# EAGLE design Patch-Prop (EAGLE 6.4)
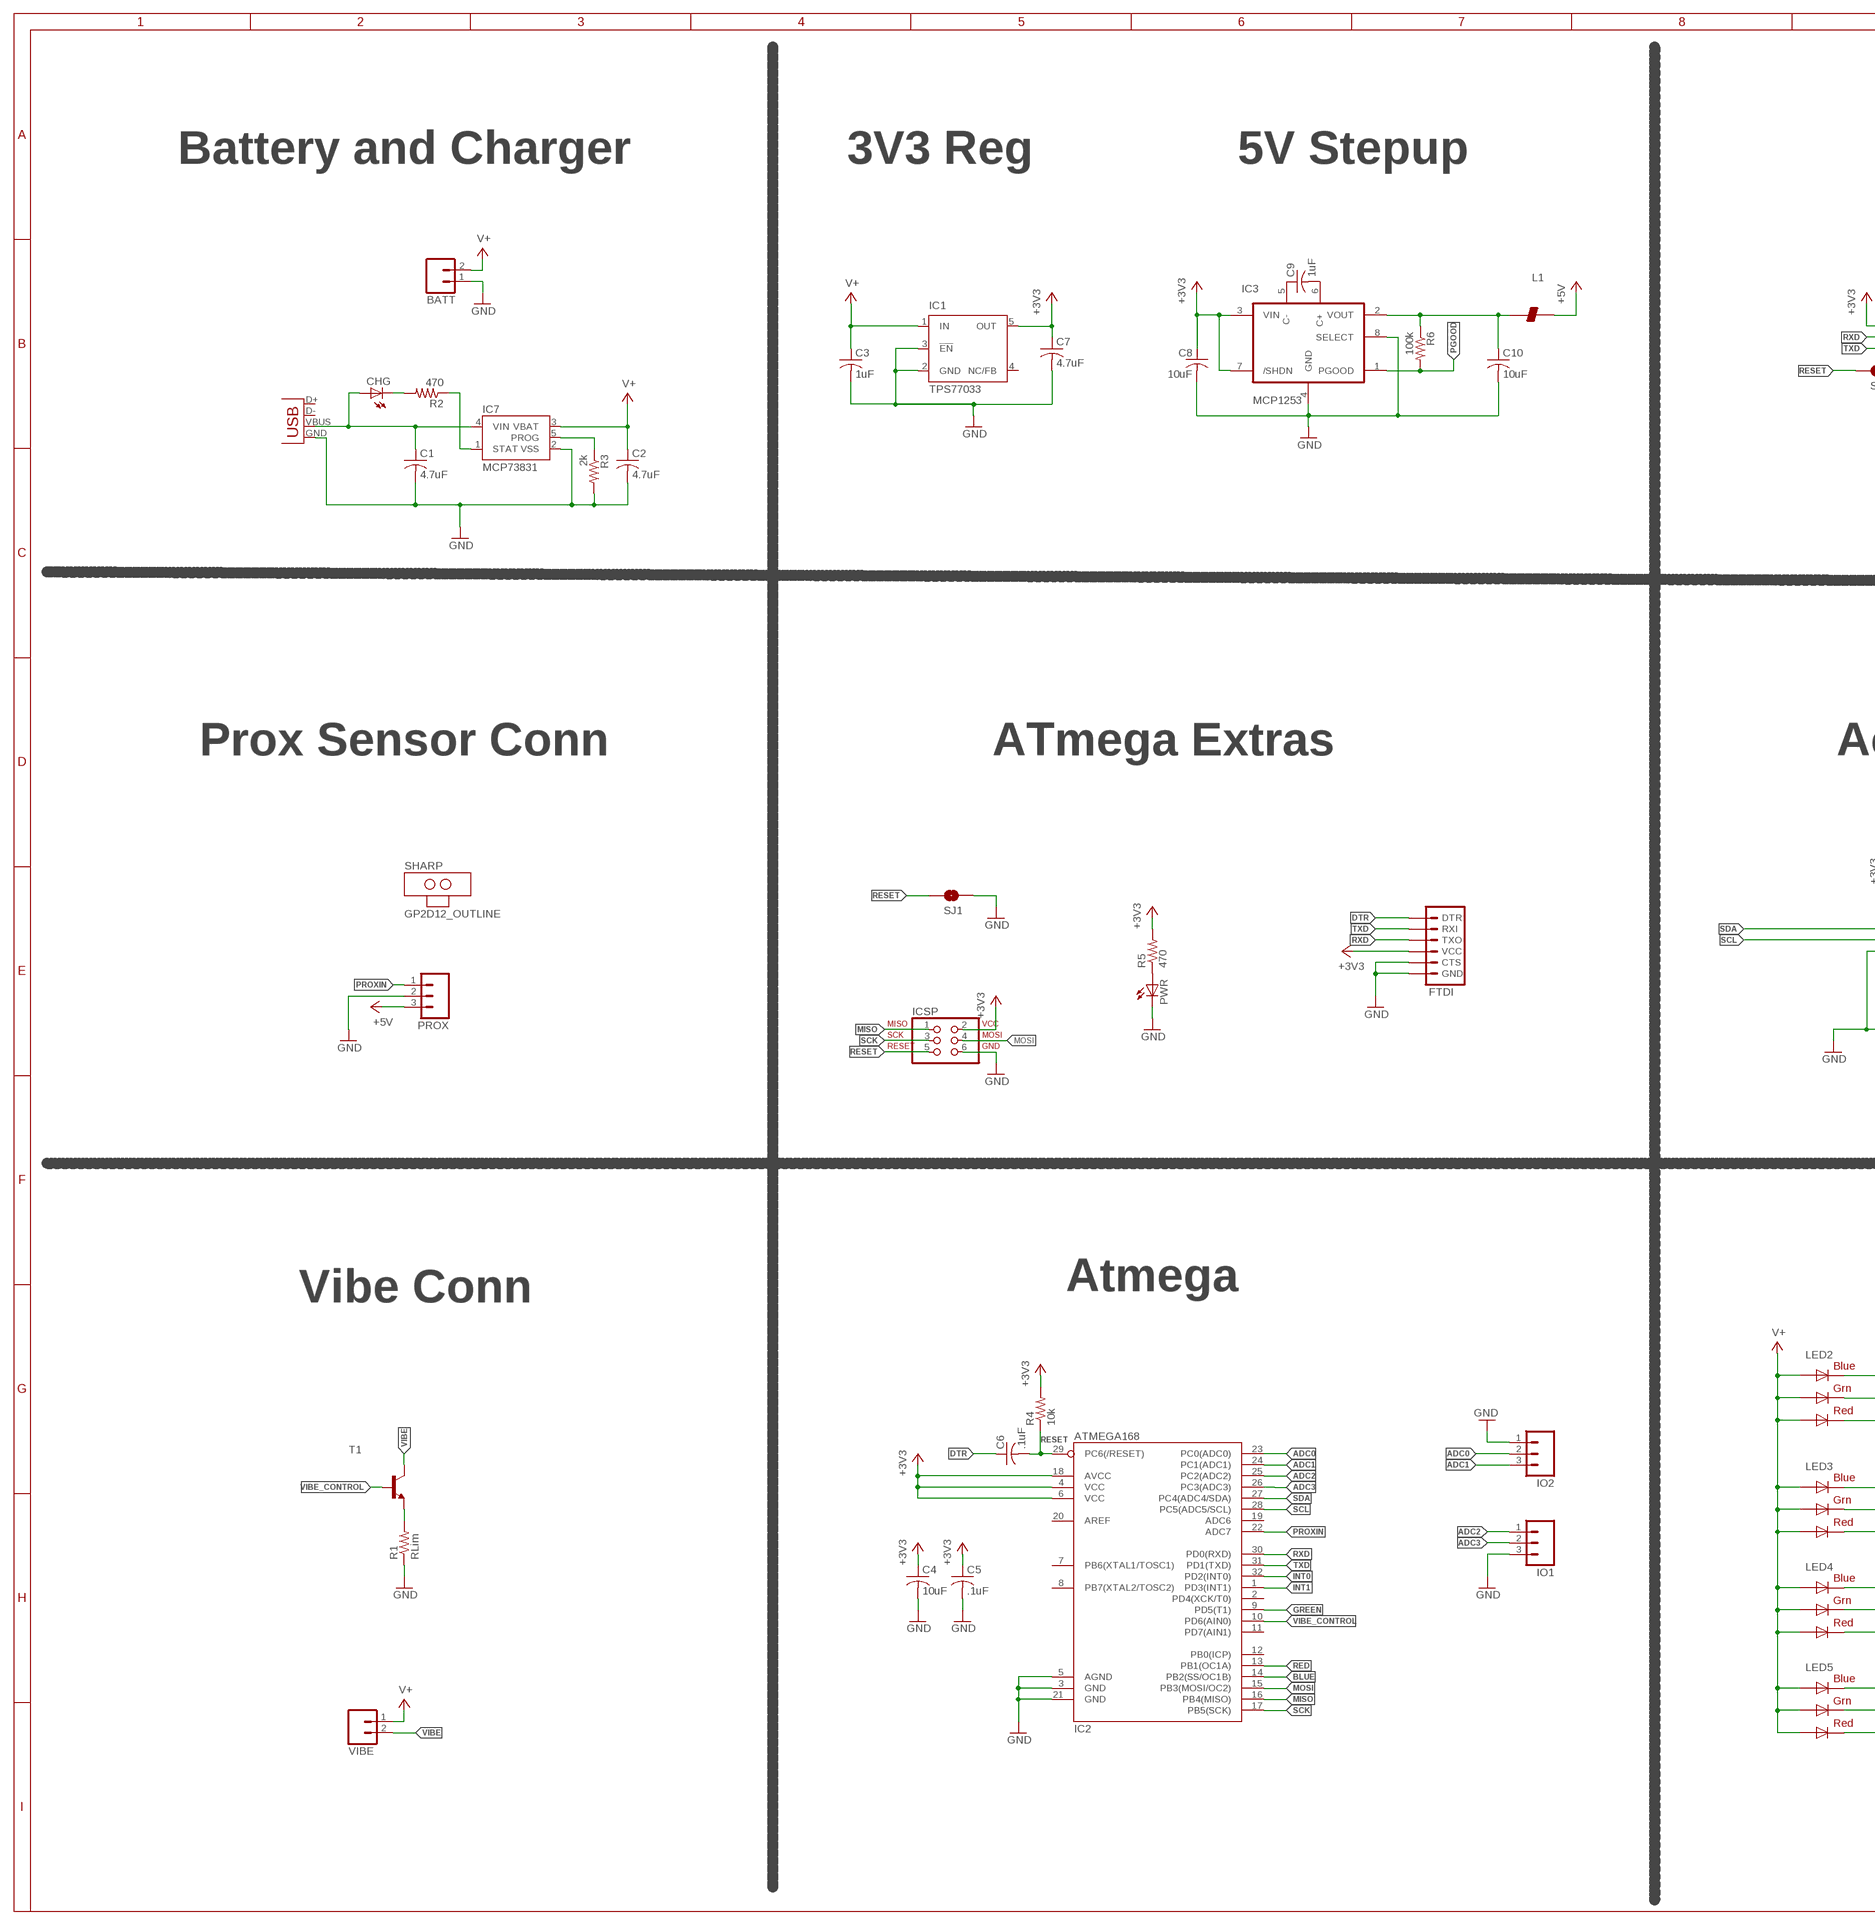
[diagram p0: schematic, sheet 1, part 1 of 2]
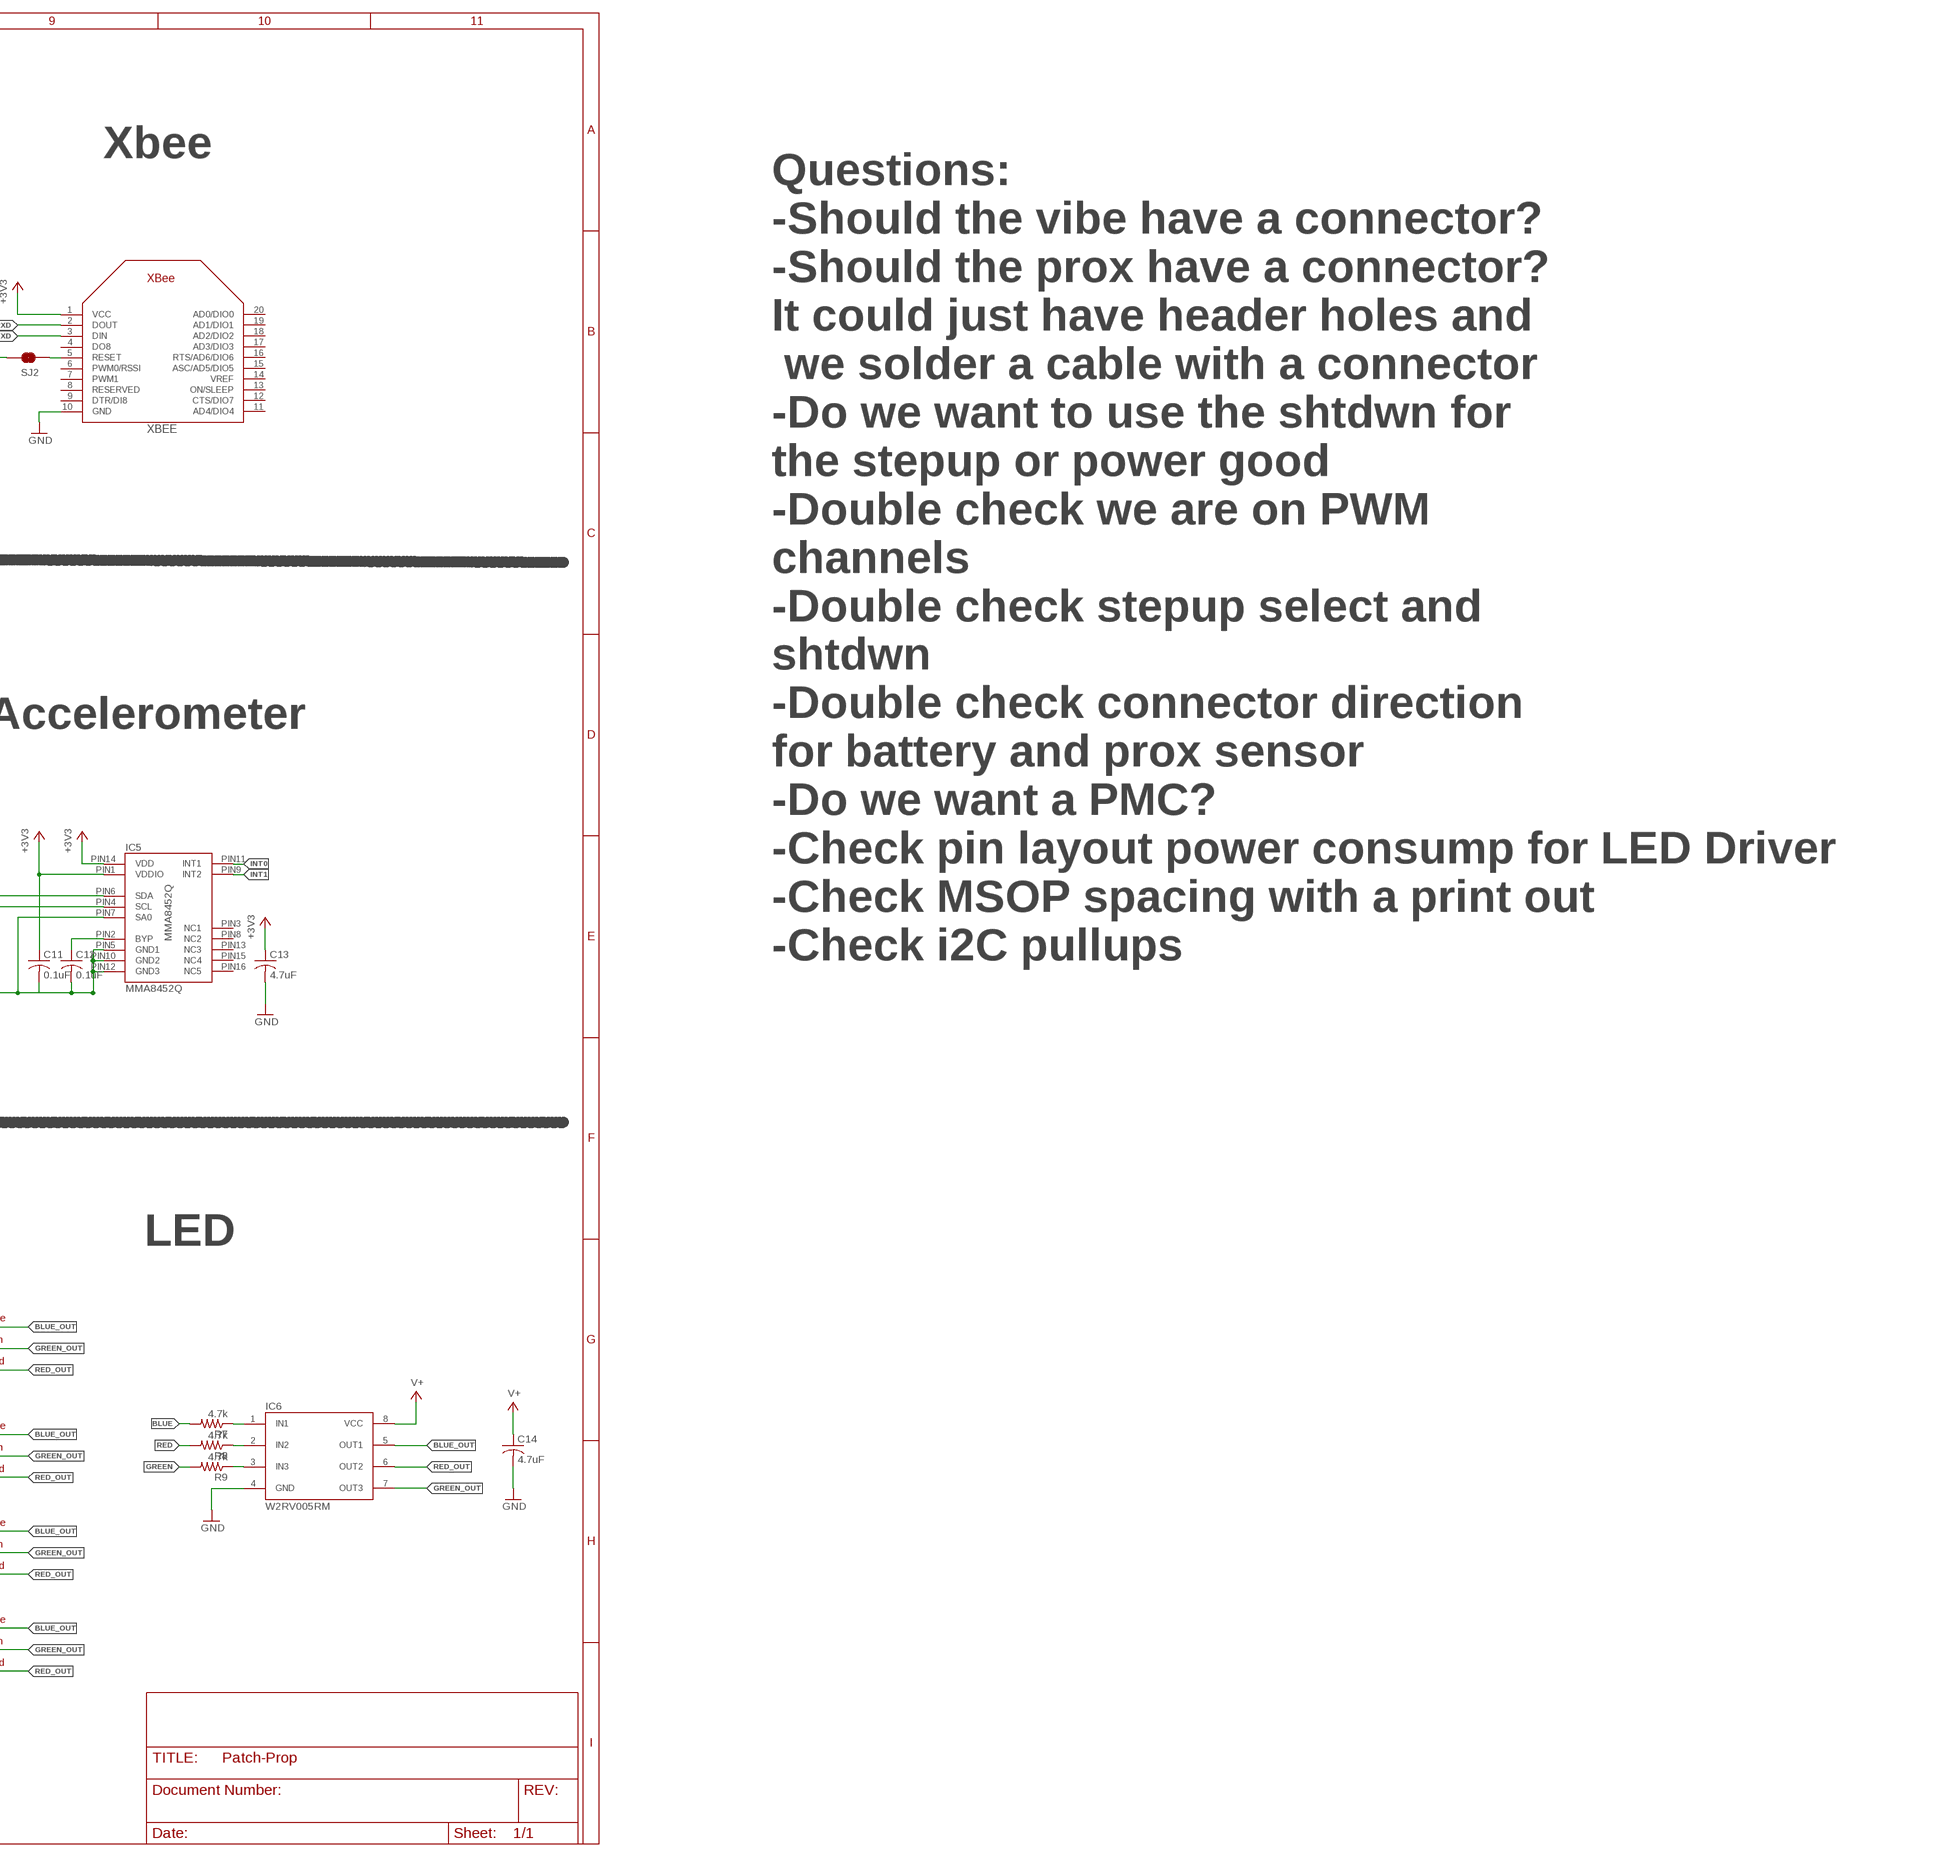
[diagram p1: schematic, sheet 1, part 2 of 2]

## Parts
BATT  M02-JST-2MM-SMT  [JST-2-SMD]
C1  4.7uF  C-USC0603  [C0603]
C2  4.7uF  C-USC0603  [C0603]
C3  1uF  C-USC0603  [C0603]
C4  10uF  C-USC0603  [C0603]
C5  .1uF  C-USC0603  [C0603]
C6  .1uF  C-USC0603  [C0603]
C7  4.7uF  C-USC0603  [C0603]
C8  10uF  C-USC0603  [C0603]
C9  1uF  C-USC0603  [C0603]
C10  10uF  C-USC0603  [C0603]
C11  0.1uF  C-USC0603  [C0603]
C12  0.1uF  C-USC0603  [C0603]
C13  4.7uF  C-USC0603  [C0603]
C14  4.7uF  C-USC0603  [C0603]
CHG  LEDCHIPLED_0805  [CHIPLED_0805]
FTDI  ARDUINO_SERIAL_PROGRAMPTH  [1X06]
IC1  TPS77033  [SOT23-DBV]
IC2  ATMEGA168  [TQFP32-08]
IC3  MCP1253  [MSOP8]
IC5  MMA8452Q  [QFN-16]
IC6  W2RV005RM  [MSOP8]
IC7  MCP73831  MCP73831SMD  [SOT23-5]
ICSP  ISP-AVR910SMD  [2X03_BORDER]
IO1  M03PTH  [1X03]
IO2  M03PTH  [1X03]
L1  BEAD-0805  [0805]
LED2  RGBLED5050  [RGBLED5050]
LED3  RGBLED5050  [RGBLED5050]
LED4  RGBLED5050  [RGBLED5050]
LED5  RGBLED5050  [RGBLED5050]
PROX  M03PTH  [1X03]
PWR  LEDCHIPLED_0805  [CHIPLED_0805]
R1  RLim  R-US_R0603  [R0603]
R2  470  R-US_R0603  [R0603]
R3  2k  R-US_R0603  [R0603]
R4  10k  R-US_R0603  [R0603]
R5  470  R-US_R0603  [R0603]
R6  100k  R-US_R0603  [R0603]
R7  4.7k  R-US_R0603  [R0603]
R8  4.7k  R-US_R0603  [R0603]
R9  4.7k  R-US_R0603  [R0603]
SHARP  GP2D12_OUTLINE  [GP2D12_OUTLINE]
SJ1  SOLDERJUMPERNO  [SJ_2S-NO]
SJ2  SOLDERJUMPERNO  [SJ_2S-NO]
T1  -NPN-SOT23-EBC  [SOT23-EBC]
USB  USBSMD  [USB-MINIB]
VIBE  M02PTH  [1X02]
XBEE  XBEE  [XBEE]

## Nets
+3V3: C4.1 C5.1 C7.1 C8.1 C11.1 C13.1 FTDI.4(VCC) IC1.5(OUT) IC2.4(VCC) IC2.6(VCC) IC2.18(AVCC) IC3.3(VIN) IC3.7(/SHDN) IC5.PIN1(VDDIO) IC5.PIN14(VDD) ICSP.2 R4.2 R5.2 XBEE.1(VCC)
+5V: L1.2 PROX.3
ADC0: IC2.23(PC0(ADC0)) IO2.2
ADC1: IC2.24(PC1(ADC1)) IO2.3
ADC2: IC2.25(PC2(ADC2)) IO1.1
ADC3: IC2.26(PC3(ADC3)) IO1.2
BLUE: IC2.14(PB2(SS/OC1B)) R7.2
BLUE_OUT: IC6.5(OUT1) LED2.4(BLUE_C) LED3.4(BLUE_C) LED4.4(BLUE_C) LED5.4(BLUE_C)
DTR: C6.1 FTDI.1(DTR)
GND: BATT.1 C1.2 C2.2 C3.2 C4.2 C5.2 C7.2 C8.2 C10.2 C11.2 C12.2 C13.2 C14.2 FTDI.5(CTS) FTDI.6(GND) IC1.2(GND) IC1.3(!EN) IC2.3(GND) IC2.5(AGND) IC2.21(GND) IC3.4(GND) IC3.8(SELECT) IC5.PIN5(GND1) IC5.PIN7(SA0) IC5.PIN10(GND2) IC5.PIN12(GND3) IC6.4(GND) IC7.2(VSS) ICSP.6 IO1.3 IO2.1 PROX.2 PWR.C R1.1 R3.2 SJ1.1 USB.GND XBEE.10(GND)
GREEN: IC2.9(PD5(T1)) R9.2
GREEN_OUT: IC6.7(OUT3) LED2.6(GREEN_C) LED3.6(GREEN_C) LED4.6(GREEN_C) LED5.6(GREEN_C)
INT0: IC2.32(PD2(INT0)) IC5.PIN11(INT1)
INT1: IC2.1(PD3(INT1)) IC5.PIN9(INT2)
MISO: IC2.16(PB4(MISO)) ICSP.1
MOSI: IC2.15(PB3(MOSI/OC2)) ICSP.4
N$3: C9.1 IC3.5(C-)
N$4: R1.2 T1.E
N$5: PWR.A R5.1
N$6: C9.2 IC3.6(C+)
N$7: IC6.1(IN1) R7.1
N$8: CHG.C R2.2
N$9: IC6.2(IN2) R8.1
N$10: C10.1 IC3.2(VOUT) L1.1 R6.1
N$11: IC7.5(PROG) R3.1
N$12: IC6.3(IN3) R9.1
N$14: IC7.1(STAT) R2.1
N$16: C12.1 IC5.PIN2(BYP)
N$19: SJ2.1 XBEE.5(RESET)
PGOOD: IC3.1(PGOOD) R6.2
PROXIN: IC2.22(ADC7) PROX.1
RED: IC2.13(PB1(OC1A)) R8.2
RED_OUT: IC6.6(OUT2) LED2.5(RED_C) LED3.5(RED_C) LED4.5(RED_C) LED5.5(RED_C)
RESET: C6.2 IC2.29(PC6(/RESET)) ICSP.5 R4.1 SJ1.2 SJ2.2
RXD: FTDI.3(TXO) IC2.30(PD0(RXD)) XBEE.2(DOUT)
SCK: IC2.17(PB5(SCK)) ICSP.3
SCL: IC2.28(PC5(ADC5/SCL)) IC5.PIN4(SCL)
SDA: IC2.27(PC4(ADC4/SDA)) IC5.PIN6(SDA)
TXD: FTDI.2(RXI) IC2.31(PD1(TXD)) XBEE.3(DIN)
USB_VIN: C1.1 CHG.A IC7.4(VIN) USB.VBUS
V+: BATT.2 C2.1 C3.1 C14.1 IC1.1(IN) IC6.8(VCC) IC7.3(VBAT) LED2.1(GREEN_A) LED2.2(RED_A) LED2.3(BLUE_A) LED3.1(GREEN_A) LED3.2(RED_A) LED3.3(BLUE_A) LED4.1(GREEN_A) LED4.2(RED_A) LED4.3(BLUE_A) LED5.1(GREEN_A) LED5.2(RED_A) LED5.3(BLUE_A) VIBE.1
VIBE: T1.C VIBE.2
VIBE_CONTROL: IC2.10(PD6(AIN0)) T1.B
Unconnected: IC1.4(NC/FB) IC2.2(PD4(XCK/T0)) IC2.7(PB6(XTAL1/TOSC1)) IC2.8(PB7(XTAL2/TOSC2)) IC2.11(PD7(AIN1)) IC2.12(PB0(ICP)) IC2.19(ADC6) IC2.20(AREF) IC5.PIN3(NC1) IC5.PIN8(NC2) IC5.PIN13(NC3) IC5.PIN15(NC4) IC5.PIN16(NC5) USB.D+ USB.D- XBEE.4(DO8) XBEE.6(PWM0/RSSI) XBEE.7(PWM1) XBEE.8(RESERVED) XBEE.9(DTR/DI8) XBEE.11(AD4/DIO4) XBEE.12(CTS/DIO7) XBEE.13(ON/SLEEP) XBEE.14(VREF) XBEE.15(ASC/AD5/DIO5) XBEE.16(RTS/AD6/DIO6) XBEE.17(AD3/DIO3) XBEE.18(AD2/DIO2) XBEE.19(AD1/DIO1) XBEE.20(AD0/DIO0)

## Notes on the sheet
- Battery and Charger | 3V3 Reg | 5V Stepup | Xbee
- Questions:
  -Should the vibe have a connector?
  -Should the prox have a connector? 
  It could just have header holes and
   we solder a cable with a connector
  -Do we want to use the shtdwn for 
  the stepup or power good
  -Double check we are on PWM 
  channels
  -Double check stepup select and 
  shtdwn
  -Double check connector direction 
  for battery and prox sensor
  -Do we want a PMC?
  -Check pin layout power consump for LED Driver
  -Check MSOP spacing with a print out
  -Check i2C pullups
- Prox Sensor Conn | ATmega Extras | Accelerometer
- Vibe Conn | Atmega | LED

## Library data of the parts
BATT = SparkFun-Connectors:M02: Header 2 Standard 2-pin 0.1" header. Use with straight break away headers (SKU : PRT-00116), right angle break away headers (PRT-00553), swiss pins (PRT-00743), machine pins (PRT-00117), and female headers (PRT-00115). Molex polarized connector foot print use with SKU : PRT-08233 with associated crimp pins and housings.; PROD_ID: CONN-08352
C1-C14 = rcl:C-US: CAPACITOR, American symbol
CHG PWR = led:LED: LED OSRAM: - CHIPLED LG R971, LG N971, LY N971, LG Q971, LY Q971, LO R971, LY R971 LH N974, LH R974 LS Q976, LO Q976, LY Q976 LO Q996 - Hyper CHIPLED LW Q18S LB Q993, LB Q99A, LB R99A - SideLED LS A670, LO A670, LY A670, LG A670, LP A670 LB A673, LV A673, LT A673, LW A673 LH A674 LY A675 LS A676, LA A676, LO A676, LY A676, LW A676 LS A679, LY A679, LG A679 - Hyper Micro SIDELED® LS Y876, LA Y876, LO Y876, LY Y876 LT Y87S - SmartLED LW L88C, LW L88S LB L89C, LB L89S, LG L890 LS L89K, LO L89K, LY L89K LS L896, LA L896, LO L896, LY L896 - TOPLED LS T670, LO T670, LY T670, LG T670, LP T670 LSG T670, LSP T670, LSY T670, LOP T670, LYG T670 LG T671, LOG T671, LSG T671 LB T673, LV T673, LT T673, LW T673 LH T674 LS T676, LA T676, LO T676, LY T676, LB T676, LH T676, LSB T676, LW T676 LB T67C, LV T67C, LT T67C, LS T67K, LO T67K, LY T67K, LW E67C LS E67B, LA E67B, LO E67B, LY E67B, LB E67C, LV E67C, LT E67C LW T67C LS T679, LY T679, LG T679 LS T770, LO T770, LY T770, LG T770, LP T770 LB T773, LV T773, LT T773, LW T773 LH T774 LS E675, LA E675, LY E675, LS T675 LS T776, LA T776, LO T776, LY T776, LB T776 LHGB T686 LT T68C, LB T68C - Hyper Mini TOPLED® LB M676 - Mini TOPLED Santana® LG M470 LS M47K, LO M47K, LY M47K Source: http://www.osram.convergy.de LUXEON: - LUMILED® LXK2-PW12-R00, LXK2-PW12-S00, LXK2-PW14-U00, LXK2-PW14-V00 LXK2-PM12-R00, LXK2-PM12-S00, LXK2-PM14-U00 LXK2-PE12-Q00, LXK2-PE12-R00, LXK2-PE12-S00, LXK2-PE14-T00, LXK2-PE14-U00 LXK2-PB12-K00, LXK2-PB12-L00, LXK2-PB12-M00, LXK2-PB14-N00, LXK2-PB14-P00, LXK2-PB14-Q00 LXK2-PR12-L00, LXK2-PR12-M00, LXK2-PR14-Q00, LXK2-PR14-R00 LXK2-PD12-Q00, LXK2-PD12-R00, LXK2-PD12-S00 LXK2-PH12-R00, LXK2-PH12-S00 LXK2-PL12-P00, LXK2-PL12-Q00, LXK2-PL12-R00 Source: www.luxeon.com KINGBRIGHT: KA-3528ASYC Source: www.kingbright.com
FTDI = SparkFun-Connectors:ARDUINO_SERIAL_PROGRAM: FTDI connector footprints
IC1 = texas:TPS770*: ULTRALOW-POWER 50-mA LOW-DROPOUT LINEAR REGULATORS 50-mA Low-Dropout Regulator Source: http://focus.ti.com/lit/ds/symlink/tps77001.pdf; MF: TEXAS INSTRUMENTS; MPN: TPS77033DBVT; OC_FARNELL: 8461570; OC_NEWARK: 77C1187
IC2 = SparkFun:ATMEGA168
IC3 = CH_Microchip:MCP1253
IC5 = eski-ic:MMA8452Q: Three axis I2C accelerometer.
IC6 = Sparky:W2RV005RM: Constant Current IC for Driving Full Color LED
IC7 = SparkFun:MCP73831
ICSP = balto:ISP-AVR910: PIN HEADER
IO1 IO2 = SparkFun:M03: Header 3 Standard 3-pin 0.1" header. Use with straight break away headers (SKU : PRT-00116), right angle break away headers (PRT-00553), swiss pins (PRT-00743), machine pins (PRT-00117), and female headers (PRT-00115). Molex polarized connector foot print use with SKU : PRT-08232 with associated crimp pins and housings.
L1 = CH_passive:BEAD
LED2-LED5 = adafruit:RGBLED: For 5050 RGB LEDs, the order of the LEDs may vary from one manufacturer to another!
PROX = SparkFun-Connectors:M03: Header 3 Standard 3-pin 0.1" header. Use with straight break away headers (SKU : PRT-00116), right angle break away headers (PRT-00553), swiss pins (PRT-00743), machine pins (PRT-00117), and female headers (PRT-00115). Molex polarized connector foot print use with SKU : PRT-08232 with associated crimp pins and housings.
R1-R9 = rcl:R-US_: RESISTOR, American symbol
SHARP = Sparky:GP2D12_OUTLINE
SJ1 SJ2 = SparkFun:SOLDERJUMPER: Solder Jumper Standard SMD solder jumper. Used to automate production. Two varients : Normally Open and Normally Closed are the same, but have different paste layers. NC will have a large amount of paste and should jumper during reflow.
T1 = transistor:*-NPN-: NPN Transistror BF959 corrected 2008.03.06
USB = SparkFun:USB: USB Connectors USB-B-PTH is fully proven SKU : PRT-00139 USB-miniB is fully proven SKU : PRT-00587 USB-A-PCB is untested. USB-A-H is throughly reviewed, but untested. Spark Fun Electronics SKU : PRT-00437 USB-B-SMT is throughly reviewed, but untested. Needs silkscreen touching up. USB-A-S has not been used/tested USB-MB-H has not been used/tested
VIBE = SparkFun-Connectors:M02: Header 2 Standard 2-pin 0.1" header. Use with straight break away headers (SKU : PRT-00116), right angle break away headers (PRT-00553), swiss pins (PRT-00743), machine pins (PRT-00117), and female headers (PRT-00115). Molex polarized connector foot print use with SKU : PRT-08233 with associated crimp pins and housings.
XBEE = adafruit:XBEE

## Net classes
1 POWER: width 0.305 mm

## Board
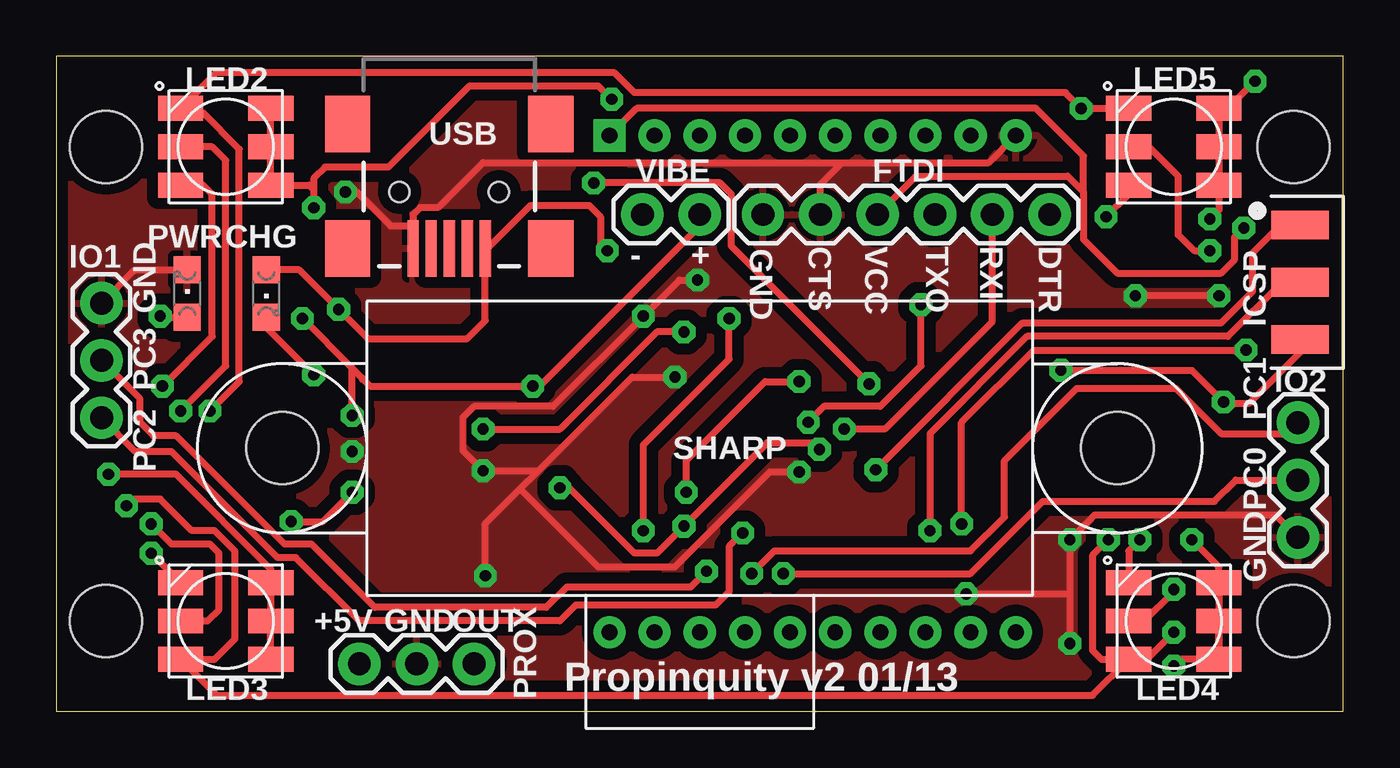
[diagram p2: board, top side]
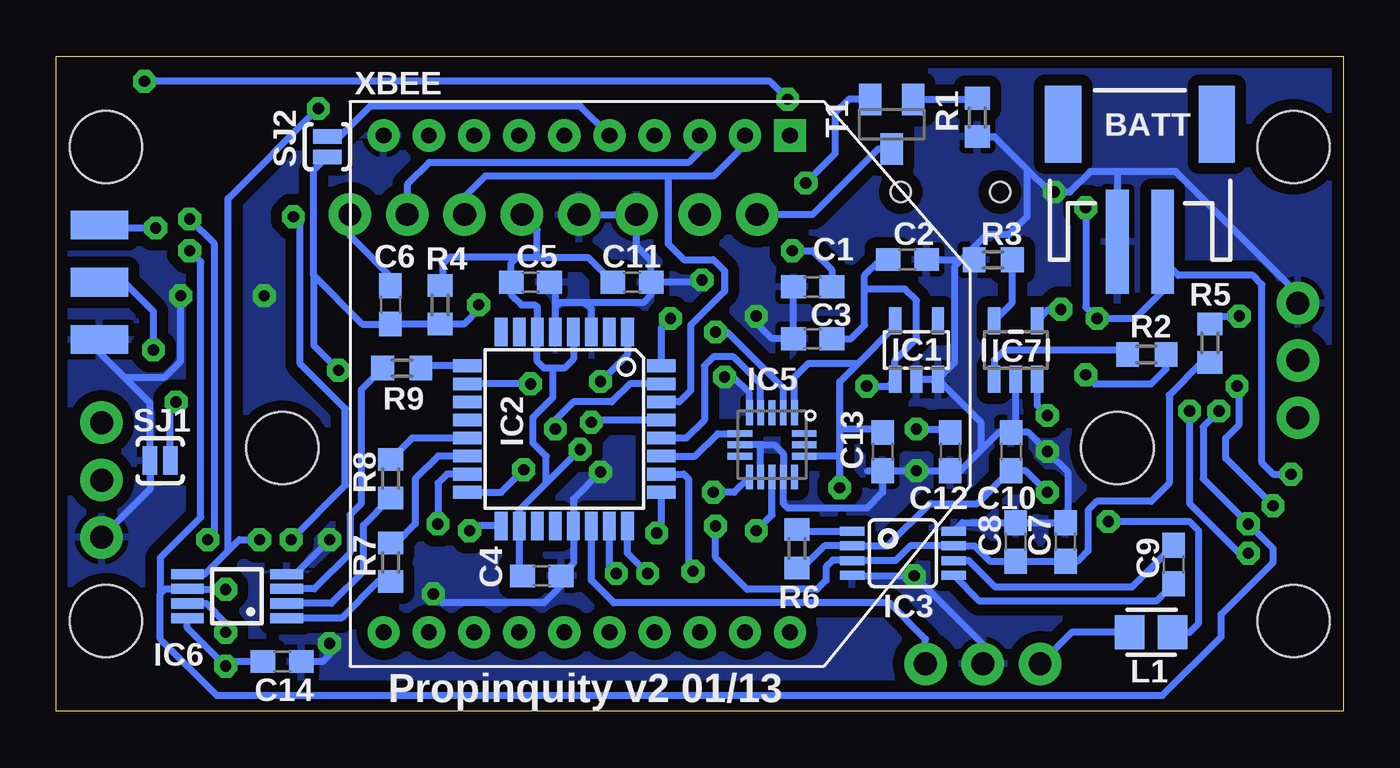
[diagram p3: board, bottom side, seen from below]

Size 57 x 29 mm. Coordinates in mm from the lower left corner, seen from the top.
Outline: 0,0 57,0 57,29 0,29 0,0
Copper layers (1*16): Top 0.035mm / dielectric 1.5mm / Bottom 0.035mm
Design rules "APC": minimum track width 7mil, minimum drill 15mil, track to track 8mil, track to pad 8mil, pad to pad 8mil, via to via 8mil, smd to smd 1mil, copper to edge 20mil, drill to drill 20mil, minimum pad ring 12mil, minimum via ring 10mil, stop-mask expansion 4mil, vias tented up to drill 25mil, thermal gap 10mil
Holes 3.2 mm at 2.2,25 2.2,4 54.8,25 54.8,4

### Footprints (pad centres in the part's own frame; a part is rotated, then mirrored left to right if it is on the bottom)
JST-2-SMD = smd 1 x 4.6: 1 -1,-3.7; 2 1,-3.7 | smd 1.6 x 3.4: NC1 -3.4,1.5; NC2 3.4,1.5
C0603 = smd 1.1 x 1: 1 -0.85,0; 2 0.85,0
CHIPLED_0805 = smd 1.2 x 1.2: A 0,-1.05; C 0,1.05
1X06 = drill 1.016 pad 1.88: 1 0,0; 2 2.54,0; 3 5.08,0; 4 7.62,0; 5 10.16,0; 6 12.7,0
SOT23-DBV = smd 0.55 x 1.2: 1 -0.95,-1.3; 2 0,-1.3; 3 0.95,-1.3; 4 0.95,1.3; 5 -0.95,1.3
TQFP32-08 = smd 1.27 x 0.559: 1 -4.293,2.8; 2 -4.293,2; 3 -4.293,1.2; 4 -4.293,0.4; 5 -4.293,-0.4; 6 -4.293,-1.2; 7 -4.293,-2; 8 -4.293,-2.8; 17 4.293,-2.8; 18 4.293,-2; 19 4.293,-1.2; 20 4.293,-0.4; 21 4.293,0.4; 22 4.293,1.2; 23 4.293,2; 24 4.293,2.8 | smd 0.559 x 1.27: 9 -2.8,-4.293; 10 -2,-4.293; 11 -1.2,-4.293; 12 -0.4,-4.293; 13 0.4,-4.293; 14 1.2,-4.293; 15 2,-4.293; 16 2.8,-4.293; 25 2.8,4.293; 26 2,4.293; 27 1.2,4.293; 28 0.4,4.293; 29 -0.4,4.293; 30 -1.2,4.293; 31 -2,4.293; 32 -2.8,4.293
MSOP8 = smd 0.4 x 1.1: 1 -0.975,-2.25; 2 -0.325,-2.25; 3 0.325,-2.25; 4 0.975,-2.25; 5 0.975,2.25; 6 0.325,2.25; 7 -0.325,2.25; 8 -0.975,2.25
QFN-16 = smd 1.1 x 0.3: PIN1 -1.425,1; PIN2 -1.425,0.5; PIN3 -1.425,0; PIN4 -1.425,-0.5; PIN5 -1.425,-1; PIN9 1.425,-1; PIN10 1.425,-0.5; PIN11 1.425,0; PIN12 1.425,0.5; PIN13 1.425,1 | smd 0.3 x 1.1: PIN6 -0.5,-1.425; PIN7 0,-1.425; PIN8 0.5,-1.425; PIN14 0.5,1.425; PIN15 0,1.425; PIN16 -0.5,1.425
MSOP8' = smd 1.45 x 0.45: 1 -2.2,0.975; 2 -2.2,0.325; 3 -2.2,-0.325; 4 -2.2,-0.975; 5 2.2,-0.975; 6 2.2,-0.325; 7 2.2,0.325; 8 2.2,0.975
SOT23-5 = smd 0.55 x 1.2: 1 -0.95,-1.3; 2 0,-1.3; 3 0.95,-1.3; 4 0.95,1.3; 5 -0.95,1.3
2X03_BORDER = smd 1.27 x 2.54: 1 -2.54,0; 3 0,0; 5 2.54,0 | smd 1.27 x 2.54 bottom: 2 -2.54,0; 4 0,0; 6 2.54,0
1X03 = drill 1.016 pad 1.88: 1 0,0; 2 2.54,0; 3 5.08,0
0805 = smd 1.3 x 1.5: 1 -0.95,0; 2 0.95,0
RGBLED5050 = smd 2 x 1.1: 1 -2,1.7; 2 -2,0; 3 -2,-1.7; 4 2,-1.7; 5 2,0; 6 2,1.7
R0603 = smd 1 x 1.1: 1 -0.85,0; 2 0.85,0
GP2D12_OUTLINE = hole 3.2: 18.5,0.15; -18.5,0.15
SJ_2S-NO = smd 0.635 x 1.27: 1 -0.45,0; 2 0.45,0
SOT23-EBC = smd 1 x 1.4: B 0.95,-1.1; C 0,1.1; E -0.95,-1.1
USB-MINIB = smd 2.5 x 0.5: D+ 2.5,0; D- 2.5,0.8; GND 2.5,-1.6; ID 2.5,-0.8; VBUS 2.5,1.6 | smd 2.5 x 2: MTN1 -3,4.5; MTN2 2.5,4.5; MTN3 -3,-4.5; MTN4 2.5,-4.5 | hole 0.9: 0,2.2; 0,-2.2
1X02 = drill 1.016 pad 1.88: 1 0,0; 2 2.54,0
XBEE = drill 0.7 pad 1.422 square: 1 -11,5.5 | drill 0.7 pad 1.422: 2 -11,3.5; 3 -11,1.5; 4 -11,-0.5; 5 -11,-2.5; 6 -11,-4.5; 7 -11,-6.5; 8 -11,-8.5; 9 -11,-10.5; 10 -11,-12.5; 11 11,-12.5; 12 11,-10.5; 13 11,-8.5; 14 11,-6.5; 15 11,-4.5; 16 11,-2.5; 17 11,-0.5; 18 11,1.5; 19 11,3.5; 20 11,5.5

### Placement (x,y rotation side)
BATT  9,24.5 0 bottom
C1  23.5,18.8 180 bottom
C2  19.3,20 0 bottom
C3  23.5,16.5 180 bottom
C4  35.5,6 0 bottom
C5  36,19 0 bottom
C6  42.2,18 270 bottom
C7  12.3,7.5 90 bottom
C8  14.5,7.5 90 bottom
C9  7.5,6.5 90 bottom
C10  14.7,11.5 90 bottom
C11  31.5,19 0 bottom
C12  17.4,11.5 270 bottom
C13  20.4,11.5 270 bottom
C14  47,2.2 0 bottom
CHG  9.3,18.5 180 top
FTDI  44,22 180 top
IC1  18.9,16 0 bottom
IC2  34.5,12.5 270 bottom
IC3  19.5,7 270 bottom
IC5  25.3,11.8 270 bottom
IC6  W2RV005RM  [MSOP8']  49,5.1 180 bottom
IC7  14.5,16 0 bottom
ICSP  55.1,19 270 top
IO1  2,13 90 top
IO2  55,7.7 90 top
L1  8.5,3.5 180 bottom
LED2  7.5,25 180 top
LED3  7.5,4 180 top
LED4  49.5,4 180 top
LED5  49.5,25 180 top
PROX  18.5,2.1 180 top
PWR  5.8,18.5 0 top
R1  16.2,26.3 90 bottom
R2  8.7,15.8 0 bottom
R3  15.5,20 180 bottom
R4  40,18 90 bottom
R5  5.9,16.3 270 bottom
R6  24.2,7.2 90 bottom
R7  42.2,6.6 90 bottom
R8  42.2,10.3 90 bottom
R9  41.7,15.2 0 bottom
SHARP  28.5,11.5 0 top
SJ1  52.4,11.1 0 bottom
SJ2  45,25 270 bottom
T1  20,26 180 bottom
USB  17.4,23 270 top
VIBE  28.5,22 180 top
XBEE  30,14.5 270 bottom

### Tracks (layer width: path | path; a pad name or v marks a point on that pad's centre or on a via)
+3V3  (via drill 0.5)
  Top 0.305: FTDI.4 38.08,23.7 44.8,23.7 45.5,23 | XBEE.1 25.7,26.7 43.4,26.7 45.5,24.6 45.5,23 | 45.5,23 45.5,20.9 47,19.4 51.6,19.4 52.2,20 52.2,21 v52.6,21.4 | v22.3,9.9 22.7,9.9 25.6,7 26.6,7 v27.8,8.2 31.5,11.9 33.5,11.9 v33.8,11.6
  Bottom 0.305: 35,15.2 35.4,15.2 35.7,15.5 IC2.6 35.7,17.9 35.8,18 36.4,18 36.85,18.45 C5.1 36.85,19.85 36.6,20.1 | FTDI.4 35.7,21.32 35.7,20.2 35.8,20.1 | C4.1 36.5,6.15 IC2.18 36.5,8.9 35.3,10.1 | 36.6,20.1 39.6,20.1 39.9,19.8 39.9,18.95 R4.2 | 36.6,20.1 35.8,20.1 | 35.8,20.1 33.45,20.1 C11.1 | IC5.PIN1 24.3,14.8 23.7,15.4 21.5,15.4 | C13.1 20.55,12.5 22.3,12.5 | 22.3,11.3 IC5.PIN14 | v22.3,9.9 22.3,11.3 | 22.3,11.3 22.3,12.5 | 22.3,12.5 22.3,14.6 21.5,15.4 | 21.5,15.4 19.85,17.05 IC1.5 | R5.2 6.25,15.45 7.7,14 7.7,10.1 8.5,9.3 10.9,9.3 11.3,8.9 11.3,7.1 11.75,6.65 C7.1 C8.1 15.65,6.65 16.32,7.33 IC3.7 19.18,7.33 19.82,6.67 IC3.3 21.77,6.7 22.6,6.7 22.9,6.4 22.9,5.8 23.3,5.4 26.4,5.4 27.8,6.8 v27.8,8.2 | 54.24,21.54 ICSP.2 54.96,21.4 v52.6,21.4 | 35,15.2 35,13.9 35.9,13 35.9,11.9 35.3,11.3 35.3,10.1 | IC2.4 34.1,15.6 34.5,15.2 35,15.2 | v33.8,11.6 35.3,10.1
+5V
  Bottom 0.305: L1.2 12.02,3.5 PROX.3
ADC0  (via drill 0.5)
  Top 0.305: v32.2,6.1 40.5,6.1 43.7,9.3 51.3,9.3 52.24,10.24 IO2.2
  Bottom 0.305: v32.2,6.1 32.5,6.4 IC2.23
ADC1  (via drill 0.5)
  Top 0.305: v30.8,6.1 31.8,7.1 40.5,7.1 42,8.6 42,11.1 45.2,14.3 49.6,14.3 51.6,12.3 54.52,12.3 IO2.3
  Bottom 0.305: v30.8,6.1 31.7,7 IC2.24
ADC2  (via drill 0.5)
  Top 0.305: v30.4,7.9 29.8,7.3 29.8,5.3 29.2,4.7 23,4.7 22.3,4 13.4,4 10.6,6.8 9.8,6.8 5.1,11.5 3.5,11.5 IO1.1
  Bottom 0.305: IC2.25 30.21,8.09 v30.4,7.9
ADC3  (via drill 0.5)
  Top 0.305: v28.8,6.2 28.1,5.5 22.6,5.5 21.7,4.6 14.1,4.6 11.3,7.4 10.1,7.4 5.3,12.2 4.3,12.2 3.7,12.8 3.7,13.84 IO1.2
  Bottom 0.305: IC2.26 29.2,10.5 29,10.3 29,6.4 v28.8,6.2
BLUE
  Bottom 0.305: IC2.14 40.1,11.3 41.1,10.3 41.1,8.3 41.95,7.45 R7.2
BLUE_OUT  (via drill 0.5)
  Top 0.305: v6.8,13.3 8.1,14.6 8.1,24.9 6.5,26.5 5.7,26.5 LED2.4 7.1,28.3 24.7,28.3 25.6,27.4 44.7,27.4 v45.4,26.7 LED5.4 | v48,7.6 47.5,7.1 LED4.4 | 5.4,5.8 LED3.4 v4.2,7
  Bottom 0.305: IC6.5 50.42,6.08 49.4,7.1 | 49.4,7.1 48.9,7.6 v48,7.6 | v45.4,26.7 49.4,22.7 49.4,7.1 | v6.8,13.3 6.8,9.2 4.6,7 v4.2,7
DTR
  Bottom 0.305: C6.1 42,19.05 44,21.05 FTDI.1
GND  (via drill 0.5)
  Top 0.305: FTDI.5 33.84,23.34 34.7,24.2 | XBEE.10 41.3,24.3 18.9,24.3 16.9,22.3 16.1,22.3 15.8,22 15.8,21.5 | 21.35,10.65 25.5,14.8 v27.4,14.8 | 6,19.75 PWR.C 3.47,19.55 IO1.3 | v28.4,19.1 27.6,19.1 v26,17.5 22,13.5 18.5,13.5 18,13 18,11.55 v18.9,10.65 21.35,10.65 | 44.9,5.2 v44.9,7.6 46,8.7 54,8.7 IO2.1 | 44.9,5.2 v44.9,3 | 20.55,9.85 19,8.3 v19,6 | 20.55,9.85 21.35,10.65 | v40.3,5.2 44.9,5.2 | 20.55,9.85 24,6.4 27.4,6.4 31.6,10.6 v32.9,10.6 | 15.8,21 USB.GND 15.8,21.5 | v51.5,18.4 v47.8,18.4 | v12.8,23 13.3,23 14.8,21.5 15.8,21.5
  Bottom 0.305: IC2.3 33.3,17.8 33.6,18.1 | 33.6,18.1 34.7,18.1 34.9,17.9 | 34.9,17.9 IC2.5 | C5.2 34.9,18.75 34.9,17.9 | C11.2 30.65,18.45 31,18.1 33.6,18.1 | FTDI.5 FTDI.6 31.3,20.6 30.65,19.95 C11.2 | C1.2 C3.2 25.3,16.5 26,17.2 v26,17.5 | 25.7,11.8 25.2,11.8 24.8,11.4 IC5.PIN12 24.8,9.2 24.6,9 21.1,9 20.4,9.7 C13.2 | IC5.PIN10 25.8,11.7 25.7,11.8 | IC3.8 16.88,8.35 C8.2 C7.2 12.2,8.45 12.2,10.6 v13.1,11.5 13.95,12.35 C10.2 | 19.35,10.65 C12.2 | 21.05,10.65 C13.2 | C13.2 v18.9,10.65 C12.2 | C12.2 17.75,10.65 | C10.2 14.65,12.35 14.5,12.5 IC7.2 | R3.2 16.35,20.55 | 16.35,20.55 15.8,21.1 14.8,21.1 14,21.9 14,24 | 10.3,21.1 BATT.1 10,23.9 | IC1.3 16.05,12.8 16.05,11.55 | IC1.3 17.2,15.45 17.2,19.7 16.9,20 | IC1.2 IC1.3 | C4.2 34.65,5.65 | R1.1 15.45,25.45 14,24 | 25.7,11.8 IC5.PIN7 | IC5.PIN5 26.3,14.1 27,14.8 v27.4,14.8 | IC6.4 46.42,6.08 v44.9,7.6 | C14.2 45.2,2.2 44.9,2.5 v44.9,3 | 10,23.9 7.4,23.9 2,18.5 IO1.3 | 10,23.9 11.2,23.9 12.1,23 v12.8,23 13,23 14,24 | v28.4,19.1 28.5,19 C11.2 | C2.2 16.9,20 | 16.9,20 16.35,20.55 | C10.2 15.25,12.35 16.05,11.55 | 16.05,11.55 16.95,10.65 C12.2 | IC3.4 21.73,6 v19,6 15.96,2.96 PROX.2 | C4.2 34.65,5.55 35.4,4.8 39.9,4.8 v40.3,5.2 | C4.2 34.1,6.55 IC2.21 34.1,9.4 v32.9,10.6 | 54,14.8 52.85,13.65 SJ1.1 52.85,9.85 IO2.1 | 54,14.8 55.1,15.9 ICSP.6 | 54,14.8 52.2,14.8 51.5,15.5 v51.5,18.4
  pour Top (isolate 0.5): 0,29 57,29 57,0 0,0
  pour Bottom (isolate 0.5): 0,29 57,29 57,0 0,0
GREEN
  Bottom 0.305: IC2.9 40.75,15.3 R9.2
GREEN_OUT  (via drill 0.5)
  Top 0.305: 47.7,2.5 LED4.6 | v49.5,3.5 48.3,2.3 LED4.6 | LED2.6 6.5,23.3 6.9,22.9 6.9,16.6 v4.7,14.4 | LED4.6 45.9,0.7 7.1,0.7 LED3.6 7,2.3 7.9,3.2 7.9,7.1 7,8 6,8 4.6,9.4 3.4,9.4 v3.1,9.1 | v46.5,21.9 47.5,22.9 LED5.6 | v46.6,7.6 45.9,6.9 45.9,2.7 46.3,2.3 LED4.6
  Bottom 0.305: IC6.7 50.38,4.78 49.5,3.9 v49.5,3.5 | v46.6,7.6 44.2,10 44.2,13.4 46.2,15.4 46.2,21.6 v46.5,21.9 | v3.1,9.1 5.2,11.2 5.2,12.1 4.6,12.7 4.6,14.3 v4.7,14.4
INT0  (via drill 0.5)
  Top 0.305: v26,8 26,11.8 29.8,15.6 v29.8,17.4
  Bottom 0.305: v29.8,17.4 30.21,16.99 IC2.32 | v26,8 25.3,8.7 IC5.PIN11
INT1  (via drill 0.5)
  Top 0.305: v27.9,9.7 27.9,11.1 31.4,14.6 v32.9,14.6
  Bottom 0.305: IC5.PIN9 26.98,9.7 v27.9,9.7 | IC2.1 31.7,15.8 v32.9,14.6
MISO  (via drill 0.5)
  Top 0.305: v36.3,10.7 42.8,17.2 51.6,17.2 53,18.6 53,20.3 54.24,21.54 ICSP.1
  Bottom 0.305: IC2.16 37.3,9.7 v36.3,10.7
MOSI  (via drill 0.5, 0.5 pad 0.41)
  Top 0.305: v40.1,8.3 40.1,12.8 43.3,16 v52.7,16
  Bottom 0.305: IC2.15 39.7,10.5 40.1,10.1 v40.1,8.3 | 55,19 ICSP.4 | 55.1,18.7 ICSP.4 | v52.7,16 52.7,17.7 54,19 ICSP.4
N$3
  Bottom 0.305: C9.1 8.25,4.9 16.12,4.9 IC3.5
N$4
  Bottom 0.305: T1.E 16.25,27.1 R1.2
N$5  (via drill 0.5)
  Top 0.305: v4.6,17.5 4.65,17.45 PWR.A
  Bottom 0.305: R5.1 5.55,17.5 v4.6,17.5
N$6
  Bottom 0.305: C9.2 9.35,5.5 15.4,5.5 16.57,6.67 IC3.6
N$7
  Bottom 0.305: R7.1 42.75,5.75 44.38,4.12 IC6.1
N$8  (via drill 0.5)
  Top 0.305: CHG.C 9.3,17 v11.4,14.9
  Bottom 0.305: v11.4,14.9 11,14.5 8.5,14.5 7.85,15.15 R2.2
N$9
  Bottom 0.305: R8.1 43.4,8.25 43.4,6.2 44.83,4.78 IC6.2
N$10  (via drill 0.5)
  Top 0.305: v10.4,8.4 11.8,8.4 v13.1,9.7
  Bottom 0.305: L1.1 6.8,3.5 6.4,3.9 6.4,8 6.8,8.4 v10.4,8.4 | v13.1,9.7 14.05,10.65 C10.1 14.95,10.4 15,10.4 16.2,9.2 18.3,9.2 20.18,7.33 IC3.2 22.98,7.33 23.95,6.35 R6.1
N$11
  Bottom 0.305: IC7.5 14.65,18.1 R3.1
N$12
  Bottom 0.305: R9.1 43.5,14.25 43.5,9.2 44,8.7 44,7 45.58,5.42 IC6.3
N$14
  Bottom 0.305: R2.1 9.75,16 15,16 15.45,15.55 IC7.1
N$16  (via drill 0.5)
  Top 0.305: v18.9,12.5 22.3,12.5 26.6,16.8 v27.8,16.8
  Bottom 0.305: IC5.PIN2 24.8,14.3 27.3,16.8 v27.8,16.8 | C12.1 17.55,12.5 v18.9,12.5
N$19
  Bottom 0.305: XBEE.5 33.8,26.8 43.1,26.8 44.45,25.45 SJ2.1
PGOOD
  Bottom 0.305: R6.2 24.12,7.97 IC3.1
PROXIN
  Bottom 0.305: IC2.22 33.3,5.8 32.3,4.8 20.1,4.8 18.5,3.2 PROX.1
RED
  Bottom 0.305: IC2.13 41.25,12.1 R8.2
RED_OUT  (via drill 0.5)
  Top 0.305: LED4.5 48.2,4 49.5,5.3 v49.5,5.4 | LED3.5 6.7,4 7.2,4.5 7.2,7 6.8,7.4 5.1,7.4 v4.2,8.3 | v5.5,13.3 7.5,15.3 7.5,24.4 6.9,25 LED2.5 | LED5.5 48.4,25 49.7,23.7 49.7,21.1 50.4,20.4 v51.1,20.4
  Bottom 0.305: 51.38,5.4 51.17,5.4 | v49.5,5.4 51,5.4 51.17,5.4 | v5.5,13.3 6.2,12.6 6.2,10.3 v4.2,8.3 3.1,7.2 3.1,6.6 5.4,4.3 5.4,3.3 8,0.7 49.9,0.7 52.4,3.2 52.4,5.2 | v51.1,20.4 50.6,19.9 50.6,8.6 52.4,6.8 52.4,5.2 | 52.4,5.2 52.17,5.42 IC6.6 51.17,5.4
RESET  (via drill 0.5)
  Top 0.305: v38.3,18 38.3,15.3 36.5,13.5 34,13.5 v33.3,12.8 | ICSP.5 55.1,15.9 52.85,13.65 51.75,13.65 v51.7,13.7 50.3,15.1 v44.5,15.1
  Bottom 0.305: v38.3,18 38.3,17.8 38.95,17.15 R4.1 C6.2 43.45,17.15 45.6,19.3 | 45.6,19.3 45.6,16.2 v44.5,15.1 | 45.6,19.3 45.6,23.95 SJ2.2 | IC2.29 33.2,12.9 v33.3,12.8 | SJ1.2 51.95,13.45 v51.7,13.7
RXD
  Bottom 0.305: 30,23.7 38,23.7 38.92,22.78 FTDI.3 | 30,23.7 29.9,23.6 29.9,20.7 29.2,20 27.9,20 27.4,19.5 27.4,18.6 28.9,17.1 28.9,14.2 29.4,13.7 IC2.30 | XBEE.2 26.5,25.1 27.9,23.7 30,23.7
SCK  (via drill 0.5 pad 0.41)
  Top 0.305: v38.7,8 38.7,12.3 43,16.6 51.9,16.6 54.3,19 | 54.1,19 54.3,19 | 54.3,19 ICSP.3
  Bottom 0.305: IC2.17 38.49,8.21 v38.7,8
SCL
  Bottom 0.305: IC5.PIN4 25.8,14.5 27,15.7 27.9,15.7 28.3,15.3 28.3,12.9 29.1,12.1 IC2.28
SDA
  Bottom 0.305: 30.6,11.3 IC2.27 28.7,11.3 27.7,12.3 IC5.PIN6
TXD  (via drill 0.5 pad 0.41)
  Top 0.305: FTDI.2 41.46,17.26 36.7,12.5 v34.9,12.5
  Bottom 0.305: IC2.31 31.6,14.5 32.4,13.7 34.1,13.7 34.9,12.9 v34.9,12.5 | XBEE.3 28.5,24.8 29,24.3 40.5,24.3 41.46,23.34 FTDI.2
USB_VIN  (via drill 0.5)
  Top 0.305: CHG.A 10.75,19.55 v12.5,17.8 13.8,16.5 18.2,16.5 19,17.3 USB.VBUS 19.1,20.5 21,22.4 23.6,22.4 24.1,21.9 24.1,20.7 v24.4,20.4
  Bottom 0.305: IC7.4 13.05,17.8 v12.5,17.8 | v24.4,20.4 23.5,20.4 22.65,19.55 C1.1
V+  (via drill 0.5)
  Top 0.305: LED3.1 LED3.2 LED3.3 9.5,6.3 5.3,10.5 v2.3,10.5 | LED2.3 LED2.2 LED2.1 11.2,23.3 11.4,23.1 | 13.55,14.75 13.9,14.4 v21.1,14.4 21.4,14.4 28.5,21.5 VIBE.1 | 13.55,14.75 13.1,15.2 | 13.1,15.2 v10.9,17.4 | LED5.1 LED5.2 LED5.3 51.9,26.7 v53.1,27.9 | LED5.1 51.7,23.5 | LED4.1 49.8,2.3 v49.5,2 | 11.4,23.1 v11.4,22.3 | v24.6,27.1 24,27.7 18.3,27.7 14.7,24.1 11.9,24.1 11.4,23.6 11.4,23.1 | v50.3,7.6 51.5,6.4 LED4.3 LED4.1 | 51.5,4.03 LED4.2 LED4.1 | IC7.3 13.55,14.75 | LED5.1 51.5,22.2 v51.1,21.8 | v13.1,13.1 13.1,15.2
  Bottom 0.305: 8,20 8,18.6 9.2,17.4 v10.9,17.4 11.4,17.9 v11.4,22.3 | 8,20 BATT.2 | 8.1,20.9 BATT.2 | v50.3,7.6 50,7.9 50,20.7 v51.1,21.8 | C14.1 49.3,2.2 v49.5,2 51.2,3.7 IC6.8 | v21.1,14.4 20.15,14.4 IC1.1 19.85,15.55 18.9,16.5 18.9,18.2 19.4,18.7 21.2,18.7 | v24.6,27.1 25.4,27.9 v53.1,27.9 | C3.1 21.8,16.5 21.2,17.1 21.2,18.7 | 21.2,18.7 21.2,19.3 20.5,20 C2.1 | v13.1,13.1 13.55,13.55 IC7.3 | 8,20 7.3,19.3 4,19.3 3.6,18.9 3.6,11 3.1,10.5 v2.3,10.5 | BATT.2 8,21
VIBE
  Bottom 0.305: T1.C 20.6,24.9 23.5,22 VIBE.2
VIBE_CONTROL  (via drill 0.5)
  Top 0.305: v23.8,23.4 29.4,23.4 29.9,22.9 29.9,20.6 v36,14.5
  Bottom 0.305: T1.B 21.9,27.1 22.5,26.5 22.5,24.7 v23.8,23.4 | v36,14.5 IC2.10

### Text on the board
tNames: GND | CTS | VCC | TXO | RXI | DTR | - | + | GND | PC3 | PC2 | PC1 | PC0 | GND | +5V | GND | OUT | Propinquity v2 01/13
bNames: Propinquity v2 01/13